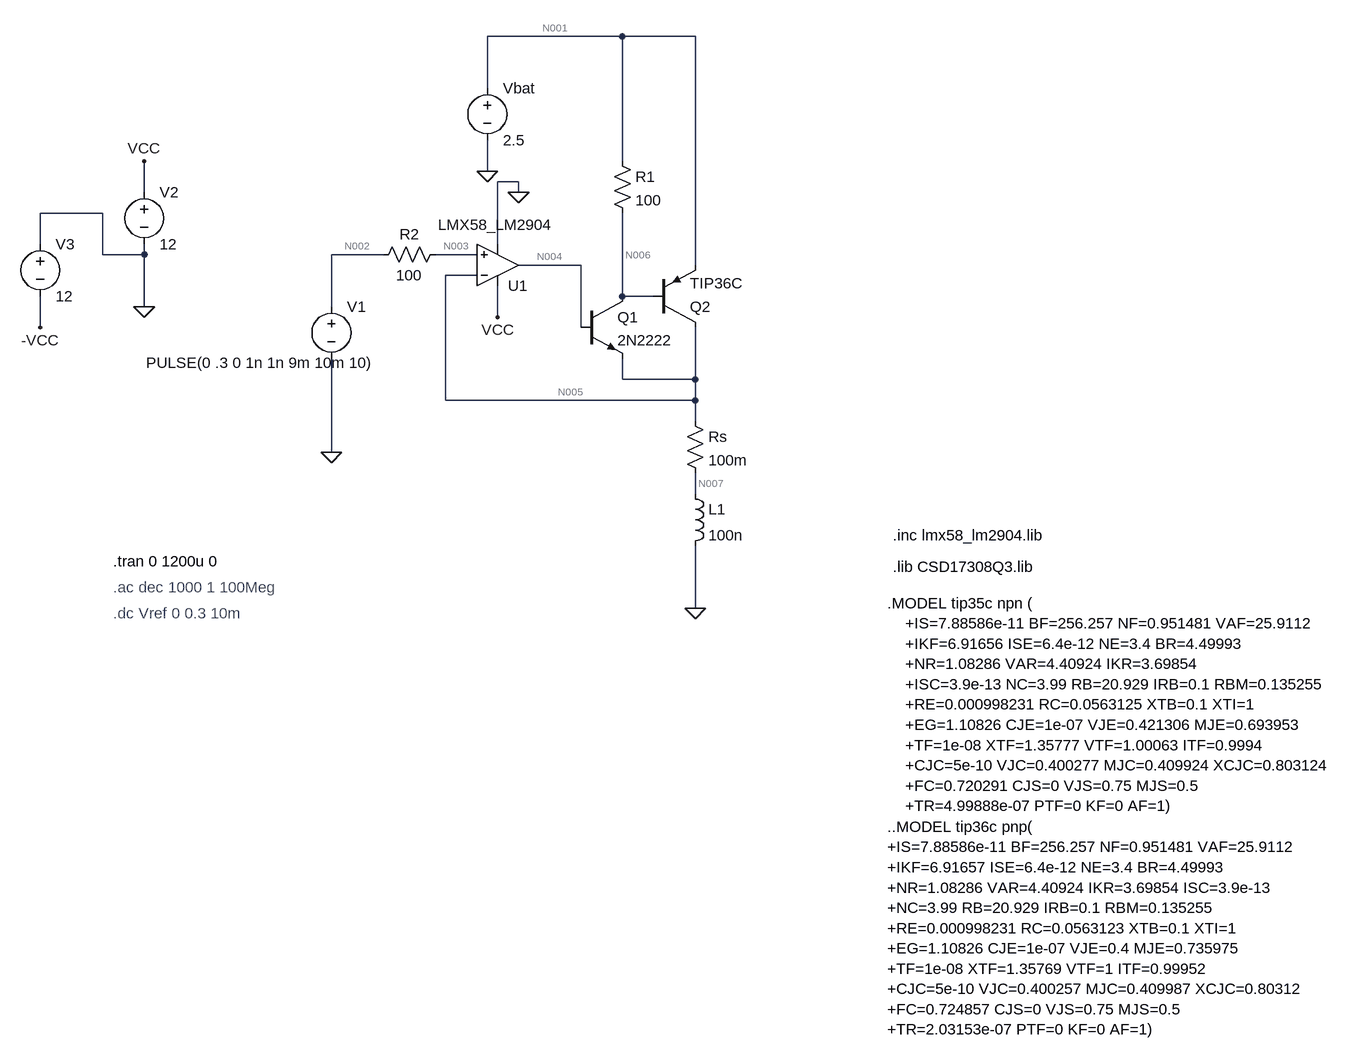
[diagram p0: schematic modulo_descarga.asc]
modulo_descarga.asc, the LTspice schematic file:
Version 4.1
SHEET 1 2224 680
WIRE 832 -912 624 -912
WIRE 944 -912 832 -912
WIRE 624 -832 624 -912
WIRE 832 -720 832 -912
WIRE 624 -704 624 -752
WIRE 672 -688 640 -688
WIRE 96 -672 96 -720
WIRE 672 -672 672 -688
WIRE 32 -640 -64 -640
WIRE -64 -592 -64 -640
WIRE 640 -592 640 -688
WIRE 32 -576 32 -640
WIRE 96 -576 96 -592
WIRE 96 -576 32 -576
WIRE 464 -576 384 -576
WIRE 608 -576 544 -576
WIRE 768 -560 672 -560
WIRE 944 -560 944 -912
WIRE 608 -544 560 -544
WIRE 832 -512 832 -640
WIRE 880 -512 832 -512
WIRE 96 -496 96 -576
WIRE 384 -496 384 -576
WIRE 640 -480 640 -528
WIRE -64 -464 -64 -512
WIRE 768 -464 768 -560
WIRE 832 -384 832 -416
WIRE 944 -384 944 -464
WIRE 944 -384 832 -384
WIRE 560 -352 560 -544
WIRE 944 -352 944 -384
WIRE 944 -352 560 -352
WIRE 944 -320 944 -352
WIRE 384 -272 384 -416
WIRE 944 -208 944 -240
WIRE 944 -32 944 -128
FLAG 944 -32 0
FLAG 96 -720 VCC
FLAG 96 -496 0
FLAG 640 -480 VCC
FLAG 384 -272 0
FLAG 624 -704 0
FLAG -64 -464 -VCC
FLAG 672 -672 0
SYMBOL OpAmps\\opamp2 640 -496 M180
WINDOW 3 -92 126 Left 2
SYMATTR Value LMX58_LM2904
SYMATTR InstName U1
SYMBOL voltage 96 -688 R0
WINDOW 123 0 0 Left 0
WINDOW 39 0 0 Left 0
SYMATTR InstName V2
SYMATTR Value 12
SYMBOL res 928 -336 R0
SYMATTR InstName Rs
SYMATTR Value 100m
SYMBOL voltage 624 -848 R0
WINDOW 123 0 0 Left 0
WINDOW 39 0 0 Left 0
SYMATTR InstName Vbat
SYMATTR Value 2.5
SYMBOL res 560 -592 R90
WINDOW 0 0 56 VBottom 2
WINDOW 3 32 56 VTop 2
SYMATTR InstName R2
SYMATTR Value 100
SYMBOL voltage -64 -608 R0
WINDOW 123 0 0 Left 0
WINDOW 39 0 0 Left 0
SYMATTR InstName V3
SYMATTR Value 12
SYMBOL npn 768 -512 R0
SYMATTR InstName Q1
SYMATTR Value 2N2222
SYMBOL voltage 384 -512 R0
WINDOW 3 -285 102 Left 2
WINDOW 123 0 0 Left 0
WINDOW 39 0 0 Left 0
SYMATTR Value PULSE(0 .3 0 1n 1n 9m 10m 10)
SYMATTR InstName V1
SYMBOL pnp 880 -464 M180
SYMATTR InstName Q2
SYMATTR Value TIP36C
SYMBOL res 816 -736 R0
SYMATTR InstName R1
SYMATTR Value 100
SYMBOL ind 928 -224 R0
SYMATTR InstName L1
SYMATTR Value 100n
TEXT 1248 -144 Left 2 !.inc lmx58_lm2904.lib
TEXT 48 -104 Left 2 !.tran 0 1200u 0
TEXT 48 -64 Left 2 ;.ac dec 1000 1 100Meg
TEXT 1248 -96 Left 2 !.lib CSD17308Q3.lib
TEXT 48 -24 Left 2 ;.dc Vref 0 0.3 10m
TEXT 1240 -40 Left 2 !.MODEL tip35c npn (\n    +IS=7.88586e-11 BF=256.257 NF=0.951481 VAF=25.9112\n    +IKF=6.91656 ISE=6.4e-12 NE=3.4 BR=4.49993\n    +NR=1.08286 VAR=4.40924 IKR=3.69854\n    +ISC=3.9e-13 NC=3.99 RB=20.929 IRB=0.1 RBM=0.135255\n    +RE=0.000998231 RC=0.0563125 XTB=0.1 XTI=1\n    +EG=1.10826 CJE=1e-07 VJE=0.421306 MJE=0.693953\n    +TF=1e-08 XTF=1.35777 VTF=1.00063 ITF=0.9994\n    +CJC=5e-10 VJC=0.400277 MJC=0.409924 XCJC=0.803124\n    +FC=0.720291 CJS=0 VJS=0.75 MJS=0.5\n    +TR=4.99888e-07 PTF=0 KF=0 AF=1)
TEXT 1240 304 Left 2 !..MODEL tip36c pnp(\n+IS=7.88586e-11 BF=256.257 NF=0.951481 VAF=25.9112\n+IKF=6.91657 ISE=6.4e-12 NE=3.4 BR=4.49993\n+NR=1.08286 VAR=4.40924 IKR=3.69854 ISC=3.9e-13\n+NC=3.99 RB=20.929 IRB=0.1 RBM=0.135255\n+RE=0.000998231 RC=0.0563123 XTB=0.1 XTI=1\n+EG=1.10826 CJE=1e-07 VJE=0.4 MJE=0.735975\n+TF=1e-08 XTF=1.35769 VTF=1 ITF=0.99952\n+CJC=5e-10 VJC=0.400257 MJC=0.409987 XCJC=0.80312\n+FC=0.724857 CJS=0 VJS=0.75 MJS=0.5\n+TR=2.03153e-07 PTF=0 KF=0 AF=1)

The netlist it stands for:
* modulo_descarga.asc
X§U1 N003 N005 VCC 0 N004 LMX58_LM2904  ; pins In+ In- V+ V- OUT
V2 VCC 0 12
Rs N005 N007 100m
Vbat N001 0 2.5
R2 N003 N002 100
V3 0 -VCC 12
Q1 N006 N004 N005 0 2N2222
V1 N002 0 PULSE(0 .3 0 1n 1n 9m 10m 10)
Q2 N005 N006 N001 0 TIP36C
R1 N001 N006 100
L1 N007 0 100n
.model NPN NPN
.model PNP PNP
.lib standard.bjt
.inc lmx58_lm2904.lib
.tran 0 1200u 0
* .ac dec 1000 1 100Meg
.lib CSD17308Q3.lib
* .dc Vref 0 0.3 10m
.MODEL tip35c npn (
    +IS=7.88586e-11 BF=256.257 NF=0.951481 VAF=25.9112
    +IKF=6.91656 ISE=6.4e-12 NE=3.4 BR=4.49993
    +NR=1.08286 VAR=4.40924 IKR=3.69854
    +ISC=3.9e-13 NC=3.99 RB=20.929 IRB=0.1 RBM=0.135255
    +RE=0.000998231 RC=0.0563125 XTB=0.1 XTI=1
    +EG=1.10826 CJE=1e-07 VJE=0.421306 MJE=0.693953
    +TF=1e-08 XTF=1.35777 VTF=1.00063 ITF=0.9994
    +CJC=5e-10 VJC=0.400277 MJC=0.409924 XCJC=0.803124
    +FC=0.720291 CJS=0 VJS=0.75 MJS=0.5
    +TR=4.99888e-07 PTF=0 KF=0 AF=1)
..MODEL tip36c pnp(
+IS=7.88586e-11 BF=256.257 NF=0.951481 VAF=25.9112
+IKF=6.91657 ISE=6.4e-12 NE=3.4 BR=4.49993
+NR=1.08286 VAR=4.40924 IKR=3.69854 ISC=3.9e-13
+NC=3.99 RB=20.929 IRB=0.1 RBM=0.135255
+RE=0.000998231 RC=0.0563123 XTB=0.1 XTI=1
+EG=1.10826 CJE=1e-07 VJE=0.4 MJE=0.735975
+TF=1e-08 XTF=1.35769 VTF=1 ITF=0.99952
+CJC=5e-10 VJC=0.400257 MJC=0.409987 XCJC=0.80312
+FC=0.724857 CJS=0 VJS=0.75 MJS=0.5
+TR=2.03153e-07 PTF=0 KF=0 AF=1)
.backanno
.end

* Results of the author's LTspice run, read from the files saved beside the schematic
* Operating Point, zero values left out:
*   V(n005) = 2.165 mV
*   V(n004) = 699.2 mV
*   V(n007) = 21.43 µV
*   V(n003) = 2.001 µV
*   V(vcc) = 12 V
*   V(n001) = 2.5 V
*   V(-vcc) = -12 V
*   V(n006) = 2.026 V
*   Ic(Q2) = -16.6 mA
*   Ib(Q2) = -66.9 µA
*   Ie(Q2) = 16.67 mA
*   I(Rs) = 21.43 mA
*   I(Vbat) = -21.41 mA
*   I(L1) = 21.43 mA
*   I(R2) = 20.01 nA
*   Ic(Q1) = 4.805 mA
*   Ib(Q1) = 24.09 µA
*   Ie(Q1) = -4.83 mA
*   I(V1) = 20.01 nA
*   I(V2) = -374.1 µA
*   I(R1) = 4.739 mA
*   Ix(u1:in+) = -20.01 nA
*   Ix(u1:in-) = -18.01 nA
*   Ix(u1:vcc) = 374.1 µA
*   Ix(u1:vee) = -350 µA
*   Ix(u1:out) = -24.09 µA
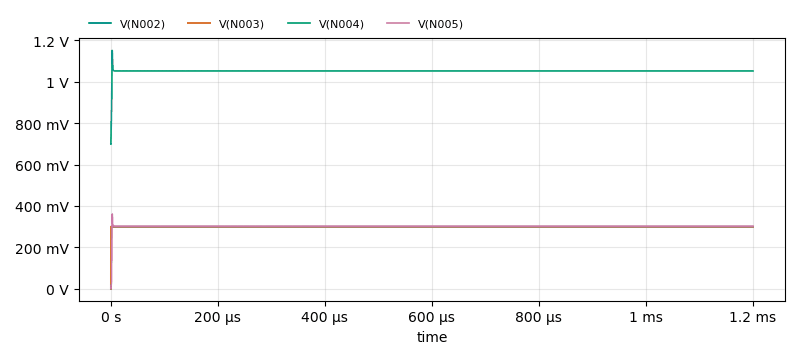
[diagram p1: Transient Analysis of modulo_descarga.asc, plotted from the saved traces]
* Transient Analysis, 1 run:
*   V(N002): min 0 V, max 300 mV, average 300 mV, rms 300 mV, last 300 mV
*   V(N003): min 2.001 µV, max 300 mV, average 300 mV, rms 300 mV, last 300 mV
*   V(N004): min 698.6 mV, max 1.152 V, average 1.052 V, rms 1.052 V, last 1.052 V
*   V(N005): min 1.496 mV, max 360.9 mV, average 301.8 mV, rms 302 mV, last 302.2 mV